# EAGLE design cypi (EAGLE 6.4)
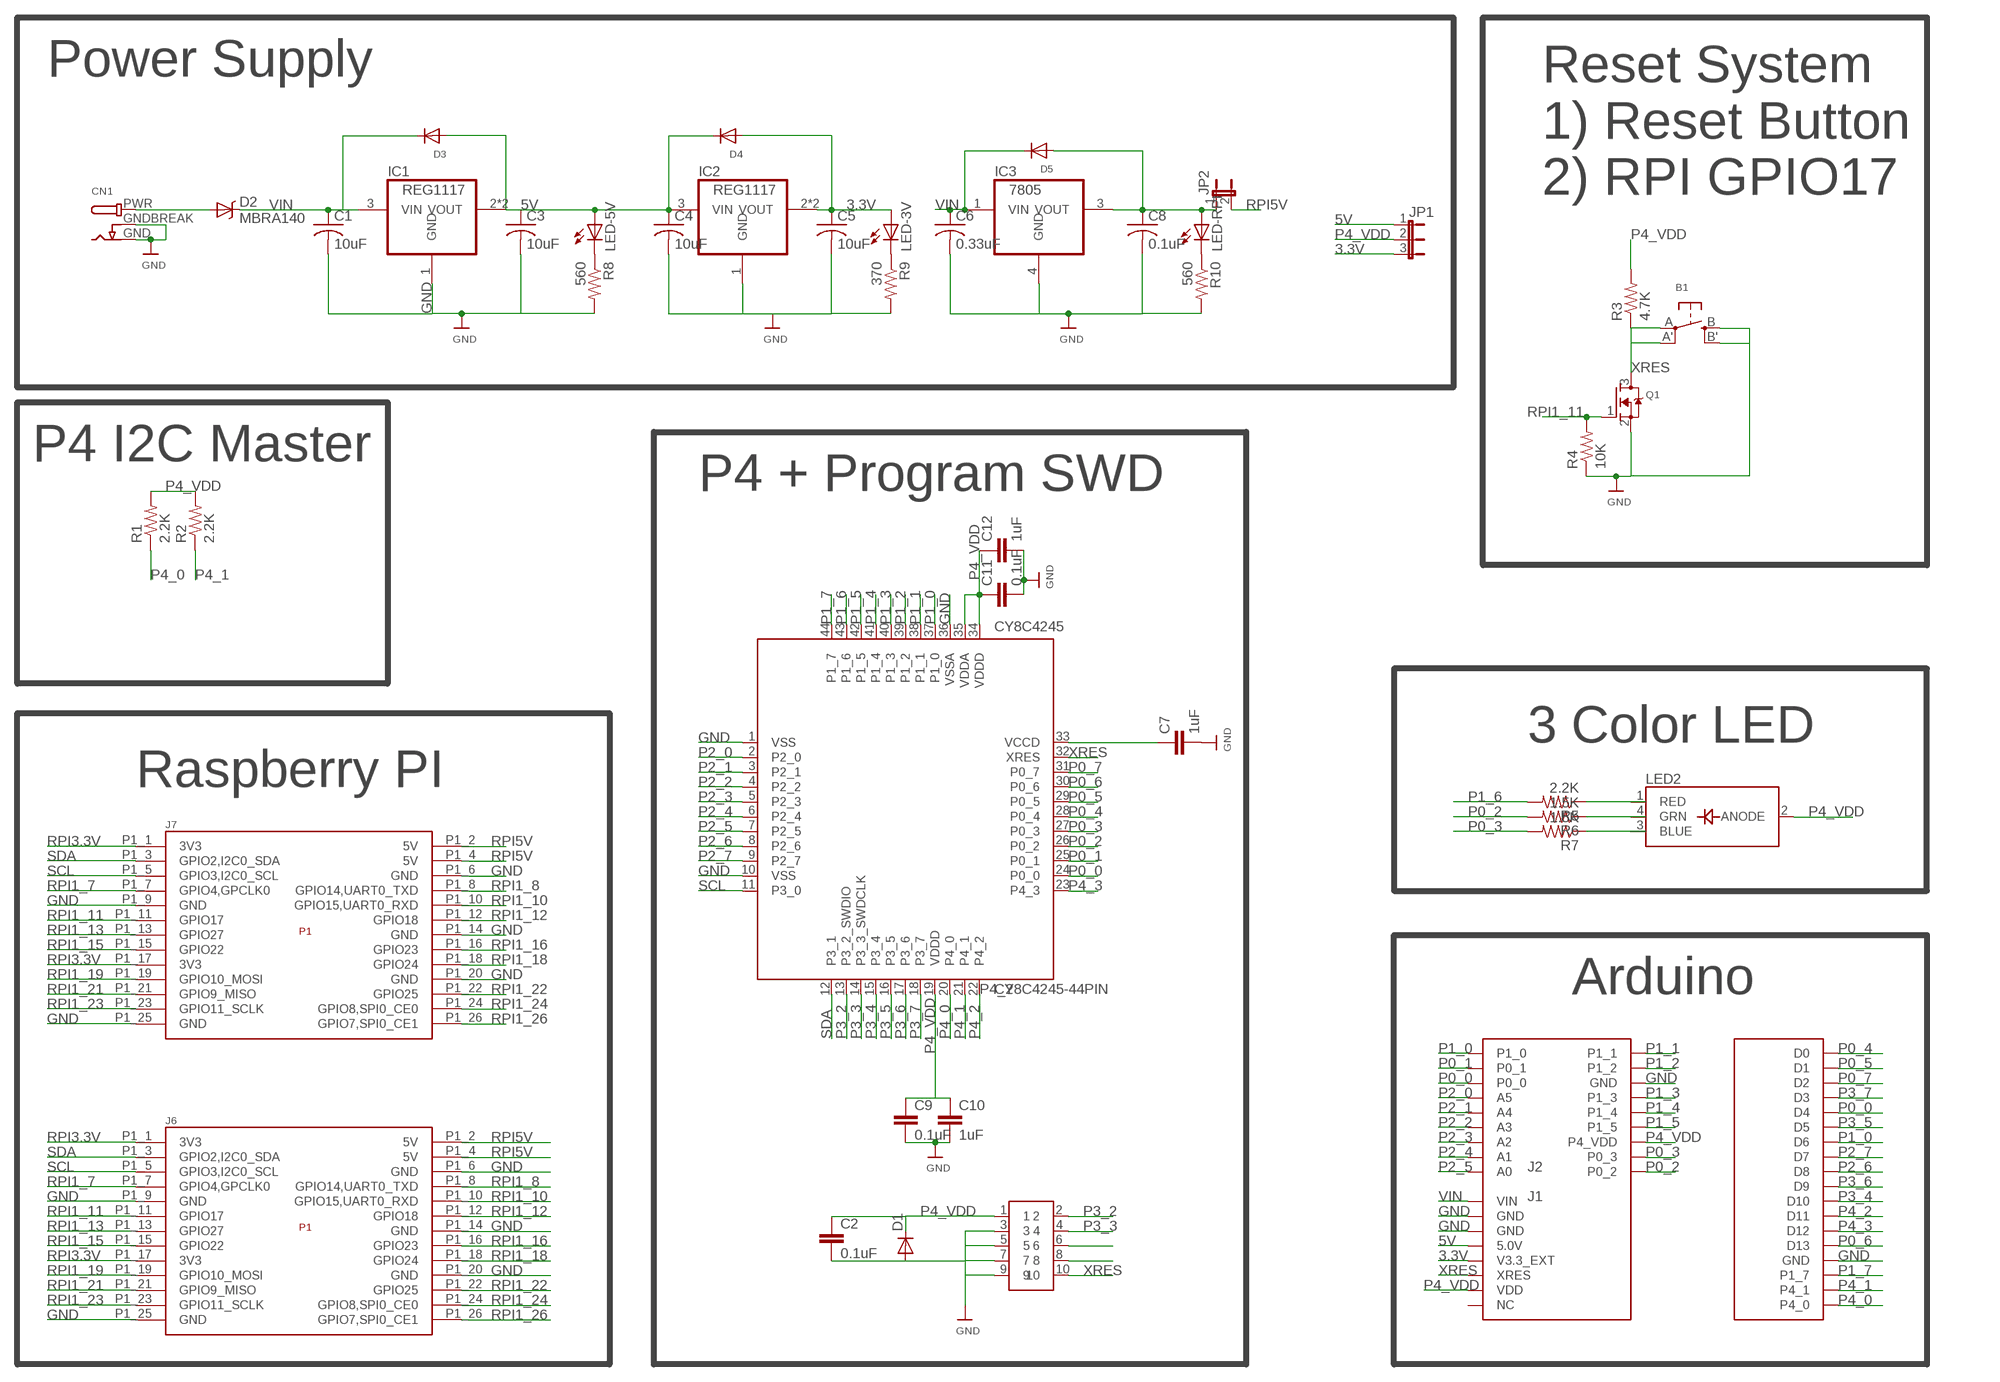
[diagram p0: schematic, sheet 1]

## Parts
B1  SWITCH_TACT_SMT  [EVQ-Q2]
C1  10uF  C-USC0805  [C0805]
C2  0.1uF  CAP1206  [1206]
C3  10uF  C-USC0805  [C0805]
C4  10uF  C-USC0805  [C0805]
C5  10uF  C-USC0805  [C0805]
C6  0.33uF  C-USC0805  [C0805]
C7  1uF  CAP1206  [1206]
C8  0.1uF  C-USC0805  [C0805]
C9  0.1uF  CAP1206  [1206]
C10  1uF  CAP1206  [1206]
C11  0.1uF  CAP1206  [1206]
C12  1uF  CAP1206  [1206]
CN1  DCBARRELPTH  [DCJACK_2MM_PTH]
CY8C4245  CY8C4245-44PIN  [TQFP-10X10-44]
D1  DIODEHV  [DIODE-HV]
D2  MBRA140  [SMA-DIODE]
D3  DIODESOD-123  [SOD-123]
D4  DIODESOD-123  [SOD-123]
D5  DIODESOD-123  [SOD-123]
IC1  REG1117  [SOT223]
IC2  REG1117  [SOT223]
IC3  7805  [DPAK]
J5  SAMTEC  [FTSH-105-01-XXX-DV-K]
J6  RASPBERRY-PI_REV2PINONLY  [RPI-PINS]
J7  RASPBERRY-PI_REV2  [RASPBERRY-PI_REV2]
JP1  JP2E  [JP2]
JP2  JUMPER-2PTH  [1X02]
LED2  LED_RGB_PLCC4  [RGBLED_PLCC4]
LED-3V  LEDCHIPLED_0805  [CHIPLED_0805]
LED-5V  LEDCHIPLED_0805  [CHIPLED_0805]
LED-RPI  LEDCHIPLED_0805  [CHIPLED_0805]
Q1  MOSFET-NREFLOW  [SOT23-R]
R1  2.2K  RESISTOR0805-RES  [0805]
R2  2.2K  RESISTOR0805-RES  [0805]
R3  4.7K  RESISTOR0805-RES  [0805]
R4  10K  RESISTOR0805-RES  [0805]
R5  2.2K  RESISTOR0805-RES  [0805]
R6  1.5K  RESISTOR0805-RES  [0805]
R7  1.5K  RESISTOR0805-RES  [0805]
R8  560  RESISTOR0805-RES  [0805]
R9  370  RESISTOR0805-RES  [0805]
R10  560  RESISTOR0805-RES  [0805]
U1  PIONEERNO_SILK  [PIONEER]

## Nets
3.3V [power]: C5.1 D4.A IC2.2(VOUT) IC2.4(VOUT) JP1.3 LED-3V.A U1.3.3V(V3.3_EXT)
5V [power]: C3.1 C4.1 D3.A D4.C IC1.2(VOUT) IC1.4(VOUT) IC2.3(VIN) JP1.1 LED-5V.A U1.5V(5.0V)
GND [power]: B1.B'(S1) B1.B(S) C1.2 C2.2 C3.2 C4.2 C5.2 C6.2 C7.2 C8.2 C9.2 C10.2 C11.2 C12.2 CN1.GND CN1.GNDBREAK CY8C4245.1(VSS) CY8C4245.10(VSS) CY8C4245.36(VSSA) D1.A IC1.1(GND) IC2.1(GND) IC3.4(GND) J5.3 J5.5 J5.7 J5.9 J6.P1_6(GND) J6.P1_9(GND) J6.P1_14(GND) J6.P1_20(GND) J6.P1_25(GND) J7.P1_6(GND) J7.P1_9(GND) J7.P1_14(GND) J7.P1_20(GND) J7.P1_25(GND) Q1.2(S) R4.1 R8.2 R9.2 R10.2 U1.GND@2(GND) U1.GND@3(GND) U1.GND@3R(GND) U1.GND@7(GND)
N$1: C7.1 CY8C4245.33(VCCD)
N$2 [power]: C8.1 D5.A IC3.3(VOUT) JP2.1 LED-RPI.A
N$3 [power]: CN1.PWR D2.A
N$4: J5.6
N$5: LED2.1(RED) R5.1
N$6: J5.8
N$7: LED2.4(GRN) R6.1
N$8: LED2.3(BLUE) R7.1
N$9: LED-5V.C R8.1
N$10: LED-3V.C R9.1
N$11: LED-RPI.C R10.1
P0_0: CY8C4245.24(P0_0) U1.D4 U1.P0_0
P0_1: CY8C4245.25(P0_1) U1.P0_1
P0_2: CY8C4245.26(P0_2) R6.2 U1.P0_2
P0_3: CY8C4245.27(P0_3) R7.2 U1.P0_3
P0_4: CY8C4245.28(P0_4) U1.D0
P0_5: CY8C4245.29(P0_5) U1.D1
P0_6: CY8C4245.30(P0_6) U1.D13
P0_7: CY8C4245.31(P0_7) U1.D2
P1_0: CY8C4245.37(P1_0) U1.D6 U1.P1_0
P1_1: CY8C4245.38(P1_1) U1.P1_1
P1_2: CY8C4245.39(P1_2) U1.P1_2
P1_3: CY8C4245.40(P1_3) U1.P1_3
P1_4: CY8C4245.41(P1_4) U1.P1_4
P1_5: CY8C4245.42(P1_5) U1.P1_5
P1_6: CY8C4245.43(P1_6) R5.2
P1_7: CY8C4245.44(P1_7) U1.AREF(P1_7)
P2_0: CY8C4245.2(P2_0) U1.A0(A5)
P2_1: CY8C4245.3(P2_1) U1.A1(A4)
P2_2: CY8C4245.4(P2_2) U1.A2(A3)
P2_3: CY8C4245.5(P2_3) U1.A3(A2)
P2_4: CY8C4245.6(P2_4) U1.A4(A1)
P2_5: CY8C4245.7(P2_5) U1.A5(A0)
P2_6: CY8C4245.8(P2_6) U1.D8
P2_7: CY8C4245.9(P2_7) U1.D7
P3_2: CY8C4245.13(P3_2_SWDIO) J5.2
P3_3: CY8C4245.14(P3_3_SWDCLK) J5.4
P3_4: CY8C4245.15(P3_4) U1.D10
P3_5: CY8C4245.16(P3_5) U1.D5
P3_6: CY8C4245.17(P3_6) U1.D9
P3_7: CY8C4245.18(P3_7) U1.D3
P4_0: CY8C4245.20(P4_0) R1.1 U1.SCL(P4_0)
P4_1: CY8C4245.21(P4_1) R2.1 U1.SDA(P4_1)
P4_2: CY8C4245.22(P4_2) U1.D11
P4_3: CY8C4245.23(P4_3) U1.D12
P4_VDD [power]: C2.1 C9.1 C10.1 C11.1 C12.1 CY8C4245.19(VDDD) CY8C4245.34(VDDD) CY8C4245.35(VDDA) D1.C J5.1 JP1.2 LED2.2(ANODE) R1.2 R2.2 R3.2 U1.P4_VDD U1.P4_VDD1(VDD)
RPI1_7: J6.P1_7(GPIO4,GPCLK0) J7.P1_7(GPIO4,GPCLK0)
RPI1_8: J6.P1_8(GPIO14,UART0_TXD) J7.P1_8(GPIO14,UART0_TXD)
RPI1_10: J6.P1_10(GPIO15,UART0_RXD) J7.P1_10(GPIO15,UART0_RXD)
RPI1_11: J6.P1_11(GPIO17) J7.P1_11(GPIO17) Q1.1(G) R4.2
RPI1_12: J6.P1_12(GPIO18) J7.P1_12(GPIO18)
RPI1_13: J6.P1_13(GPIO27) J7.P1_13(GPIO27)
RPI1_15: J6.P1_15(GPIO22) J7.P1_15(GPIO22)
RPI1_16: J6.P1_16(GPIO23) J7.P1_16(GPIO23)
RPI1_18: J6.P1_18(GPIO24) J7.P1_18(GPIO24)
RPI1_19: J6.P1_19(GPIO10_MOSI) J7.P1_19(GPIO10_MOSI)
RPI1_21: J6.P1_21(GPIO9_MISO) J7.P1_21(GPIO9_MISO)
RPI1_22: J6.P1_22(GPIO25) J7.P1_22(GPIO25)
RPI1_23: J6.P1_23(GPIO11_SCLK) J7.P1_23(GPIO11_SCLK)
RPI1_24: J6.P1_24(GPIO8,SPI0_CE0) J7.P1_24(GPIO8,SPI0_CE0)
RPI1_26: J6.P1_26(GPIO7,SPI0_CE1) J7.P1_26(GPIO7,SPI0_CE1)
RPI3.3V: J6.P1_1(3V3) J6.P1_17(3V3) J7.P1_1(3V3) J7.P1_17(3V3)
RPI5V [power]: J6.P1_2(5V) J6.P1_4(5V) J7.P1_2(5V) J7.P1_4(5V) JP2.2
SCL: CY8C4245.11(P3_0) J6.P1_5(GPIO3,I2C0_SCL) J7.P1_5(GPIO3,I2C0_SCL)
SDA: CY8C4245.12(P3_1) J6.P1_3(GPIO2,I2C0_SDA) J7.P1_3(GPIO2,I2C0_SDA)
VIN [power]: C1.1 C6.1 D2.C D3.C D5.C IC1.3(VIN) IC3.1(VIN) U1.VIN
XRES: B1.A'(P1) B1.A(P) CY8C4245.32(XRES) J5.10 Q1.3(D) R3.1 U1.XRES
Unconnected: U1.NC@8(NC)

## Notes on the sheet
- Power Supply
- Reset System
  1) Reset Button
  2) RPI GPIO17
- P4 I2C Master
- P4 + Program SWD
- 3 Color LED
- Raspberry PI
- Arduino
- J2
- J1

## Library data of the parts
B1 = microbuilder:SWITCH_TACT_SMT: SMT Tact Switches 6x6mm - Digikey: P12940SCT-ND KMR2 (4.6x2.8mm) - Digikey: 401-1426-1-ND EVQ-PQHB55 - Light Touch, 160GF (4.5x4.5mm) - Digikey: P8090SCT-ND
C1 C3-C6 C8 = adafruit:C-US: CAPACITOR, American symbol
C2 C7 C9-C12 = SparkFun-Passives:CAP: Capacitor Standard 0603 ceramic capacitor, and 0.1" leaded capacitor.
CN1 = microbuilder:DCBARREL: DC Barrel Jack DCJACK_1.3MM_PTH - Through Hole 1.3mm Jack (4UConnector: 05536) DCJACK_2MM_PTH - Through Hole 2.0/2.1 Jack (4UConnector: 05537) DCJACK_2MM_SMT - SMT 2.0/2.1mm Jack(4UConnector: 03267)
CY8C4245 = arh:CY8C4245-44PIN: Cypress PSoC4 8C4245
D1 = SparkFun-DiscreteSemi:DIODE: Diode
D2 = SparkFun-DiscreteSemi:MBRA140: 40V, 1A Schottky rectifier SMA/DO-214AC package DIO-08053; PROD_ID: DIO-08053
D3-D5 = adafruit:DIODE: Diode
IC1 IC2 = arh:REG1117: 800mA and 1A Low Dropout (LDO) Positive Regulator 1.8V, 2.5V, 2.85V, 3.3V, 5V, and Adj; MPN: REG1117; OC_FARNELL: 1097566; OC_NEWARK: 14P6981
IC3 = arh:7805
J5 = arh:SAMTEC
J6 J7 = arh:RASPBERRY-PI_REV2: Raspberry Pi Board <http://www.raspberrypi.org/> Jacques Lagnel V1.0 (beta) 2012 Mateusz Bawaj V1.1 (beta) 2012 Board dimension: Forum 3D model <http://www.raspberrypi.org/forum/general-discussion/mechanical-profile-3d-models?value=3d%20model&type=1&include=1&search=1&ret=all> The GPIO Connector (P1): http://elinux.org/RPi_Low-level_peripherals The GPIO Connector (P5): http://www.raspberrypi-spy.co.uk/2012/09/raspberry-pi-p5-header/
JP1 = jumper:JP2E: JUMPER
JP2 = SparkFun-Passives:JUMPER-2: Jumper Basic 0.1" spaced jumper. Use with breakaway headers.
LED2 = microbuilder:LED_RGB_PLCC4: RGB LED - PLCC4 Cree 20mA Common Anode Digikey: CLV1A-FKB-CJ1M1F1BB7R4S3CT-ND Red: 2.6V Vf, 550mcd Green: 3.2V Vf, 850mcd Blue: 3.2V Vf, 320mcd
LED-3V LED-5V LED-RPI = adafruit:LED: LED OSRAM: - CHIPLED LG R971, LG N971, LY N971, LG Q971, LY Q971, LO R971, LY R971 LH N974, LH R974 LS Q976, LO Q976, LY Q976 LO Q996 - Hyper CHIPLED LW Q18S LB Q993, LB Q99A, LB R99A - SideLED LS A670, LO A670, LY A670, LG A670, LP A670 LB A673, LV A673, LT A673, LW A673 LH A674 LY A675 LS A676, LA A676, LO A676, LY A676, LW A676 LS A679, LY A679, LG A679 - Hyper Micro SIDELED® LS Y876, LA Y876, LO Y876, LY Y876 LT Y87S - SmartLED LW L88C, LW L88S LB L89C, LB L89S, LG L890 LS L89K, LO L89K, LY L89K LS L896, LA L896, LO L896, LY L896 - TOPLED LS T670, LO T670, LY T670, LG T670, LP T670 LSG T670, LSP T670, LSY T670, LOP T670, LYG T670 LG T671, LOG T671, LSG T671 LB T673, LV T673, LT T673, LW T673 LH T674 LS T676, LA T676, LO T676, LY T676, LB T676, LH T676, LSB T676, LW T676 LB T67C, LV T67C, LT T67C, LS T67K, LO T67K, LY T67K, LW E67C LS E67B, LA E67B, LO E67B, LY E67B, LB E67C, LV E67C, LT E67C LW T67C LS T679, LY T679, LG T679 LS T770, LO T770, LY T770, LG T770, LP T770 LB T773, LV T773, LT T773, LW T773 LH T774 LS E675, LA E675, LY E675, LS T675 LS T776, LA T776, LO T776, LY T776, LB T776 LHGB T686 LT T68C, LB T68C - Hyper Mini TOPLED® LB M676 - Mini TOPLED Santana® LG M470 LS M47K, LO M47K, LY M47K Source: http://www.osram.convergy.de/
Q1 = microbuilder:MOSFET-N: N-Channel Mosfet LEGEND VDS: Voltage Drain-Source ID: Drain Current RDS(ON): Drain-Source On-State Resistance VGS(TH): Gate-Source Threshold Voltage CISS: Drain-Source Input Capacitance SOT-23 Name VDS ID RDS(ON) VGS(TH) CISS Order Number 2N7002E 60V 260mA 2.5 Ohm 2.5V @ 250uA 26.7pF @ 25V 2N7002ET1GOSTR-ND BSH103 30V 850mA 400 mOhm 400mV @ 1mA 83pF @ 24V BSH103,235-ND BSS138 60V 320mA 1.6 Ohm 1.5V @ 250uA 50pF @ 10V Mouser: 771-BSS138PW115 DMN2075U-7 20V 4.2A 38 mOhm 1V @ 250 uA 594.3pF @ 10V DMN2075U-7DICT-ND * BSS138 good choice for I2C level-shifting
R1-R10 = SparkFun-Passives:RESISTOR: Resistor Basic schematic elements and footprints for 0603, 1206, and PTH resistors.
U1 = arh:PIONEER: Arduino shield footprint

## Net classes
1 power: width 1.016 mm, clearance 0.254 mm

## Board
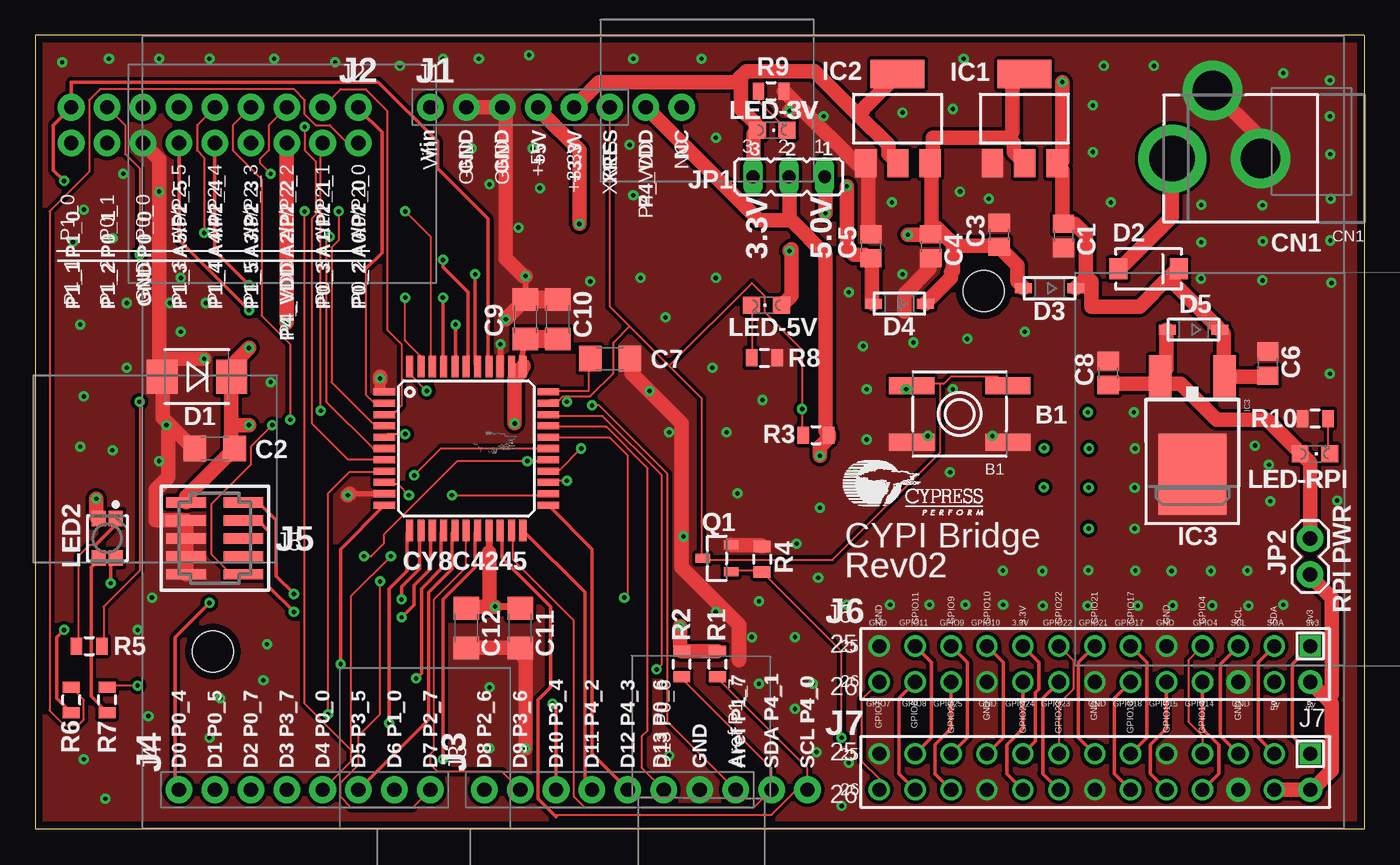
[diagram p1: board, top side]
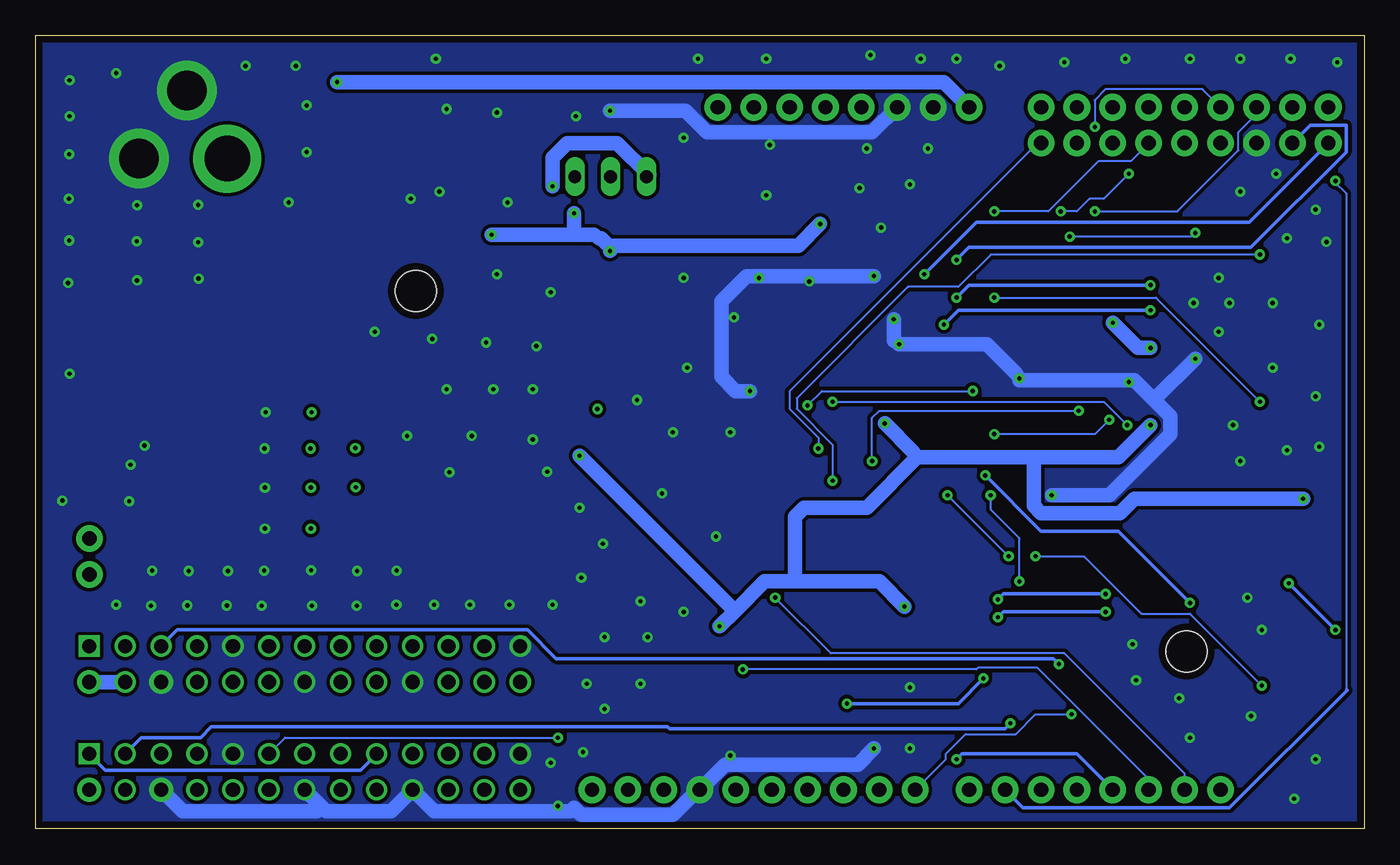
[diagram p2: board, bottom side, seen from below]

Size 93.99 x 56.08 mm. Coordinates in mm from the lower left corner, seen from the top.
Outline: 93.98,0 0,0 0,56.08 93.95,56.08
Outline: 93.98,0 93.98,0
Outline: 93.98,56.08 93.98,0
Copper layers (1*16): Top 0.0178mm / dielectric 59mil / Bottom 0.0178mm
Design rules "SSC-EAGLE-2Lyr_v1.0.0.3 *": minimum track width 6mil, minimum drill 14mil, track to track 6mil, track to pad 6mil, pad to pad 6mil, via to via 6mil, smd to smd 6mil, copper to edge 20mil, drill to drill 16mil, minimum pad ring 8mil, minimum via ring 8mil, stop-mask expansion 3mil, vias tented up to drill 14mil, thermal gap 10mil

### Footprints (pad centres in the part's own frame; a part is rotated, then mirrored left to right if it is on the bottom)
EVQ-Q2 = smd 3.2 x 1.2: A -3.4,-2; A' 3.4,-2; B -3.4,2; B' 3.4,2
C0805 = smd 1.3 x 1.5: 1 -0.85,0; 2 0.85,0
1206 = smd 1.6 x 1.8: 1 -1.4,0; 2 1.4,0
DCJACK_2MM_PTH = drill 2.8: GND 0,7.35; GNDBREAK 4.8,10.75 | drill 3.2: PWR 0,13.6
TQFP-10X10-44 = smd 1.5 x 0.5: 1 -5.8,4; 2 -5.8,3.2; 3 -5.8,2.4; 4 -5.8,1.6; 5 -5.8,0.8; 6 -5.8,0; 7 -5.8,-0.8; 8 -5.8,-1.6; 9 -5.8,-2.4; 10 -5.8,-3.2; 11 -5.8,-4; 23 5.8,-4; 24 5.8,-3.2; 25 5.8,-2.4; 26 5.8,-1.6; 27 5.8,-0.8; 28 5.8,0; 29 5.8,0.8; 30 5.8,1.6; 31 5.8,2.4; 32 5.8,3.2; 33 5.8,4 | smd 0.5 x 1.5: 12 -4,-5.8; 13 -3.2,-5.8; 14 -2.4,-5.8; 15 -1.6,-5.8; 16 -0.8,-5.8; 17 0,-5.8; 18 0.8,-5.8; 19 1.6,-5.8; 20 2.4,-5.8; 21 3.2,-5.8; 22 4,-5.8; 34 4,5.8; 35 3.2,5.8; 36 2.4,5.8; 37 1.6,5.8; 38 0.8,5.8; 39 0,5.8; 40 -0.8,5.8; 41 -1.6,5.8; 42 -2.4,5.8; 43 -3.2,5.8; 44 -4,5.8
DIODE-HV = smd 2.2 x 2.4: A 2.454,0; C -2.454,0
SMA-DIODE = smd 1.27 x 1.47: A -2.15,0; C 2.15,0
SOD-123 = smd 1.2 x 0.7: A 1.85,0; C -1.85,0
SOT223 = smd 1.499 x 2.007: 1 -2.261,-3.15; 2 0.025,-3.15; 3 2.311,-3.15 | smd 3.81 x 2.007: 4 0,3.15
DPAK = smd 1.6 x 3: 1 -2.28,-5.31; 3 2.28,-5.31 | smd 4.826 x 5.715: 4 0,1.588
FTSH-105-01-XXX-DV-K = smd 0.737 x 2.794: 1 -2.54,-2.032; 2 -2.54,2.032; 3 -1.27,-2.032; 4 -1.27,2.032; 5 0,-2.032; 6 0,2.032; 7 1.27,-2.032; 8 1.27,2.032; 9 2.54,-2.032; 10 2.54,2.032
RPI-PINS = drill 1 square: P1_1 0,-2.54 | drill 1 pad 1.676: P1_2 0,0; P1_6 5.08,0 | drill 1: P1_3 2.54,-2.54; P1_4 2.54,0; P1_5 5.08,-2.54; P1_7 7.62,-2.54; P1_8 7.62,0; P1_9 10.16,-2.54; P1_10 10.16,0; P1_11 12.7,-2.54; P1_12 12.7,0; P1_13 15.24,-2.54; P1_14 15.24,0; P1_15 17.78,-2.54; P1_16 17.78,0; P1_17 20.32,-2.54; P1_18 20.32,0; P1_19 22.86,-2.54; P1_20 22.86,0; P1_21 25.4,-2.54; P1_22 25.4,0; P1_23 27.94,-2.54; P1_24 27.94,0; P1_25 30.48,-2.54; P1_26 30.48,0
RASPBERRY-PI_REV2 = drill 1 square: P1_1 -41.91,21.59 | drill 1 pad 1.676: P1_2 -41.91,24.13; P1_6 -36.83,24.13 | drill 1: P1_3 -39.37,21.59; P1_4 -39.37,24.13; P1_5 -36.83,21.59; P1_7 -34.29,21.59; P1_8 -34.29,24.13; P1_9 -31.75,21.59; P1_10 -31.75,24.13; P1_11 -29.21,21.59; P1_12 -29.21,24.13; P1_13 -26.67,21.59; P1_14 -26.67,24.13; P1_15 -24.13,21.59; P1_16 -24.13,24.13; P1_17 -21.59,21.59; P1_18 -21.59,24.13; P1_19 -19.05,21.59; P1_20 -19.05,24.13; P1_21 -16.51,21.59; P1_22 -16.51,24.13; P1_23 -13.97,21.59; P1_24 -13.97,24.13; P1_25 -11.43,21.59; P1_26 -11.43,24.13 | hole 2.9: 35.69,14.365; -18.81,-11.135
JP2 = drill 0.914 long: 1 -2.54,0; 2 0,0; 3 2.54,0
1X02 = drill 1.016 pad 1.88: 1 0,0; 2 2.54,0
RGBLED_PLCC4 = smd 1.1 x 1: 1 -1.4,0.6; 2 -1.4,-0.6; 3 1.4,-0.6; 4 1.4,0.6
CHIPLED_0805 = smd 1.2 x 1.2: A 0,-1.05; C 0,1.05
SOT23-R = smd 0.635 x 1.016: 1 -0.95,-1; 2 0.95,-1; 3 0,1
0805 = smd 0.8 x 1.2: 1 -0.9,0; 2 0.9,0
PIONEER = drill 1.016 pad 1.88: 3.3V 50.8,13.97; 5V 50.8,16.51; A0 50.8,29.21; A1 50.8,31.75; A2 50.8,34.29; A3 50.8,36.83; A4 50.8,39.37; A5 50.8,41.91; AREF 2.54,2.54; D0 2.54,41.91; D1 2.54,39.37; D2 2.54,36.83; D3 2.54,34.29; D4 2.54,31.75; D5 2.54,29.21; D6 2.54,26.67; D7 2.54,24.13; D8 2.54,20.32; D9 2.54,17.78; D10 2.54,15.24; D11 2.54,12.7; D12 2.54,10.16; D13 2.54,7.62; GND@2 50.8,21.59; GND@3 50.8,19.05; GND@3R 48.26,44.45; GND@7 2.54,5.08; NC@8 50.8,6.35; P0_0 50.8,44.45; P0_1 50.8,46.99; P0_2 48.26,29.21; P0_3 48.26,31.75; P1_0 50.8,49.53; P1_1 48.26,49.53; P1_2 48.26,46.99; P1_3 48.26,41.91; P1_4 48.26,39.37; P1_5 48.26,36.83; P4_VDD 48.26,34.29; P4_VDD1 50.8,8.89; SCL 2.54,-2.54; SDA 2.54,0; VIN 50.8,24.13; XRES 50.8,11.43

### Placement (x,y rotation side)
B1  65.38,29.31 180 top
C1  72.72,41.91 270 top
C2  12.7,26.87 180 top
C3  68.17,41.99 90 top
C4  63.32,41.17 270 top
C5  59.11,41.17 90 top
C6  87.17,32.87 90 top
C7  40.64,33.22 0 top
C8  75.87,32.21 90 top
C9  34.67,36.02 90 top
C10  36.96,36.02 90 top
C11  34.29,14.17 270 top
C12  30.48,14.17 270 top
CN1  94.01,47.37 90 top
CY8C4245  30.48,26.87 0 top
D1  11.43,31.95 180 top
D2  78.74,39.57 0 top
D3  71.73,38.2 180 top
D4  61.11,37.11 180 top
D5  81.92,35.28 180 top
IC1  69.95,50.19 0 top
IC2  60.99,50.19 0 top
IC3  81.84,26.64 180 top
J5  12.7,20.52 270 top
J6  90.17,10.36 180 top
J7  48.26,26.87 180 top
JP1  53.29,46.1 180 top
JP2  90.17,20.5 270 top
LED2  5.08,20.52 270 top
LED-3V  52.12,49.38 270 top
LED-5V  51.71,37.01 90 top
LED-RPI  90.5,26.49 270 top
Q1  48.21,19.1 90 top
R1  48.26,11.63 90 top
R2  45.72,11.63 90 top
R3  55.22,27.81 0 top
R4  51.41,19.05 270 top
R5  3.81,12.9 0 top
R6  2.54,9.09 90 top
R7  5.08,9.09 90 top
R8  51.56,33.27 0 top
R9  52.04,52.15 0 top
R10  90.53,28.98 180 top
U1  52.07,0.2 90 top

### Tracks (layer width: path | path; a pad name or v marks a point on that pad's centre or on a via)
3.3V  (via drill 0.3)
  Top 1.016: D4.A 59.18,37.16 59.18,40.21 C5.1 58.67,40.59 57.91,40.59 57.4,41.1 v57.4,45.42 | JP1.3 50.8,46.18 50.8,49.1 51.05,49.35 LED-3V.A 50.93,49.86 49.91,50.88 49.91,52.78 49.78,52.78 | 58.23,50.43 55.12,53.54 50.29,53.54 49.78,53.04 49.78,52.78 | 58.23,50.43 60.33,48.34 60.33,47.7 60.96,47.07 IC2.2 | U1.3.3V 39.88,52.78 49.78,52.78 | IC2.4 60.96,53.29 58.55,50.88 58.55,50.75 58.23,50.43
  Bottom 1.016: v57.4,45.42 57.4,47.45 56.39,48.46 52.83,48.46 50.55,46.18 JP1.3
5V  (via drill 0.3)
  Top 1.016: 53.47,40.97 53.47,40.84 | 53.47,40.84 53.47,37.67 52.83,37.03 LED-5V.A | D3.A 69.85,38.3 69.47,38.68 69.47,39.83 68.2,41.1 C3.1 67.69,41.22 64.9,41.22 | C4.1 63.37,42.11 63.37,46.94 IC2.3 63.5,47.45 63.5,48.84 68.83,48.84 | 68.83,48.84 69.22,48.46 69.22,47.83 69.98,47.07 IC1.2 | 64.9,41.22 64.9,41.35 63.75,42.49 C4.1 | v61.72,41.99 62.87,41.99 C4.1 | v38.48,42.75 38.48,47.96 35.81,50.62 U1.5V | 64.9,41.22 64.9,39.45 64.77,39.32 64.77,38.94 62.99,37.16 D4.C | v53.34,40.84 53.47,40.84 | v55.88,43.51 55.88,46.05 JP1.1 | IC1.4 69.85,53.29 69.09,52.53 69.09,49.23 68.83,48.84
  Bottom 1.016: v61.72,41.99 55.88,41.99 | 55.88,41.99 54.48,41.99 54.1,41.73 53.98,41.73 53.59,41.35 53.18,41.08 | v38.48,42.75 40.01,41.22 53.09,41.22 53.18,41.08 | v53.34,40.84 53.18,41.08 | v55.88,43.51 55.88,41.99
GND  (via drill 0.3)
  Top 0.406: C9.2 v34.67,39.07 | CY8C4245.10 22.23,23.67 22.23,23.7 | CY8C4245.1 24.38,31 | CY8C4245.36 32.89,32.67 v32.89,34.24
  Top 0.762: 24.38,31 24.38,31.7
  Top 1.016: J5.9 J5.7 J5.5 J5.3 8.51,21.79 8.51,23.95 9.4,24.84 9.4,28.02 9.72,28.33 | 9.72,28.33 9.02,29.03 9.02,31.95 D1.A 8.76,32.33 8.76,33.22 | 9.72,28.33 11.18,26.87 C2.2 | U1.GND@3R 8.76,47.32 8.76,33.22 | U1.GND@2 U1.GND@3 33.27,50.75 33.27,40.34 34.54,39.07 v34.67,39.07 | 34.42,12.27 34.67,12.01 v34.67,5.66 | Q1.2 49.28,20.02 51.31,20.02 R4.1 | 58.29,46.81 53.85,51.26 | 53.85,51.26 52.96,52.15 R9.2 | 42.16,33.22 42.16,32.21 v43.43,30.94 45.72,28.65 45.72,18.49 49.78,14.43 49.78,11.89 | v22.1,23.57 22.23,23.67 | 24.38,31.95 v24.38,31.83 24.38,31.7 | v33.27,36.02 34.29,37.03 C9.2 | v11.94,33.22 8.76,33.22 | 58.93,46.69 58.93,42.11 C5.2 | 63.25,40.08 63.25,39.57 61.47,37.8 61.47,36.53 | v53.34,50.75 53.85,51.26 | C12.2 C11.2 | 86.61,47.32 CN1.GND 86.49,47.83 86.49,48.97 83.31,52.15 CN1.GNDBREAK
  Top 1.27: C9.2 C10.2
  Bottom 0.406: v34.67,39.07 34.67,39.19
  Bottom 1.016: v34.67,5.66 35.81,4.52 45.21,4.52 U1.GND@7 47.37,2.49 48.9,0.97 55.37,0.97 55.88,1.47 56.13,1.22 65.79,1.22 J7.P1_20 68.83,1.22 73.41,1.22 73.72,1.54 | J7.P1_14 73.72,1.54 | J7.P1_6 83.57,1.22 74.04,1.22 73.72,1.54 | v43.43,30.94 44.45,30.94 45.47,31.95 45.47,37.29 43.69,39.07 v34.67,39.07 | 30.73,51 U1.GND@2 | v22.1,23.57 18.03,23.57 13.72,27.89 13.72,29.16 14.86,30.3 | 14.86,30.3 16.26,31.7 24.38,31.7 v24.38,31.83 24.64,32.21 26.67,34.24 v32.89,34.24 33.27,34.49 v33.27,36.02 | 14.86,30.3 v11.94,33.22 | v53.34,50.75 48.01,50.75 46.48,49.23 34.8,49.23 U1.GND@3
  other vias: 53.85,20.14 55.37,17.73 57.4,15.82 60.45,15.82 63.25,15.82 65.79,15.82 68.45,15.82 71.25,15.75 74.42,15.75 77.98,15.75 80.44,15.77 83.24,15.77 85.8,15.75 88.27,15.82 91.57,32.16 91.67,38.58 91.59,41.58 91.62,44.53 91.59,47.68 91.57,50.37 91.57,52.91 88.27,53.42 79.12,53.92 75.56,53.92 74.8,51.13 74.8,47.83 86.82,41.53 82.47,41.45 55.5,22.68 57.78,25.22 58.8,27.51 58.8,31.06 58.55,34.11 62.1,34.37 65.91,34.62 69.98,35.13 49.66,23.7 30.86,48.08 32.13,45.54 34.16,42.49 39.24,38.68 44.58,36.14 47.88,32.59 48.13,38.94 48.13,48.84 76.07,44.27 82.47,44.09 35.18,48.08 35.69,45.29 42.8,38.94 53.72,13.54 51.18,16.08 48.13,15.32 50.67,13.54 54.99,10.24 71.22,18.21 74.47,18.26 85.72,18.24 87.25,25.73 51.44,30.3 67.69,27.76 63.12,27.76 82.45,38.89 86.79,38.76 44.83,28.02 3.43,30.56 2.67,41.48 3.17,35.64 6.48,37.16 9.53,37.16 3.17,27 3.43,4.9 4.95,2.11 16.38,13.03 12.32,6.43 13.08,9.22 16.13,10.49 31.37,54.43 34.92,54.69 42.29,54.43 47.12,54.43 25.78,53.92 5.21,54.43 1.91,54.18 8.76,54.43 12.32,54.43 16.89,54.43 21.21,54.18 5.46,26.75 9.27,28.52 8.26,16.33 7.24,14.05 8,7.95 6.48,32.59 8.76,45.03 48.9,28.02 51.18,10.24 55.24,5.41 65.66,54.43 65.41,45.03 61.34,50.62 64.9,50.88 42.29,44.78 42.04,48.34 10.29,38.94 12.06,37.16 10.29,35.13 8.76,25.98 16.64,31.57 6.22,46.3 3.43,43.76 5.46,41.73 28.83,54.43 45.85,20.65 53.72,8.46 57.53,4.65 57.02,1.6 92.08,23.19 57.53,37.92 67.44,44.53 61.59,31.06 64.9,31.06 60.58,44.27 55.75,50.37 61.34,39.19 44.83,5.16 32.13,9.98 32.13,5.66 68.43,18.24 77.8,18.24 80.37,18.21 83.13,18.21 64.69,25.2 77.7,29.44 77.77,26.87 77.75,24.1 77.75,21.21 86.79,44.07 86.26,27.08 87.35,23.14
  pour Bottom (no thermals): -1.04,56.87 94.74,56.87 94.74,-1.98 -1.22,-1.98 -1.22,56.77
  pour Top (no thermals): -1.04,56.87 94.74,56.87 94.74,-1.98 -1.22,-1.98 -1.22,56.77
GND1  (via drill 0.3)
  other vias: 74.45,29.44 74.52,26.87 74.5,24.1 74.5,21.21
GND2  (via drill 0.3)
  other vias: 71.35,26.9 71.32,24.13
N$1
  Top 0.152: CY8C4245.33 36.32,30.94 39.12,30.94 39.12,33.22 C7.1
N$2
  Top 1.016: JP2.1 90.17,25.86 89.53,26.49 LED-RPI.A 89.15,26.87 87.12,28.91 83.57,28.91 81.03,31.45 80.01,31.45 IC3.3 | D5.A 80.01,35.26 80.01,32.46 79.76,32.21 IC3.3 | C8.1 75.95,31.45 79.5,31.45 IC3.3
N$3
  Top 1.016: D2.A 76.71,39.57 80.39,43.26 80.39,47.32 CN1.PWR
N$5
  Top 0.152: R5.1 3.05,12.9 3.05,19.25 3.81,20.02 4.32,20.02 4.25,20.08
  Top 0.254: 4.19,20.02 4.25,20.08 5.46,21.29 5.46,21.79 5.59,21.92 LED2.1 | 2.92,12.9 R5.1
N$7  (via drill 0.3)
  Top 0.254: v5.33,17.35 5.33,18.75 5.59,19 LED2.4 | v2.03,14.05 1.52,13.54 1.52,9.22 2.54,8.2 R6.1
  Bottom 0.254: v2.03,14.05 v5.33,17.35
N$8
  Top 0.254: LED2.3 4.45,19 3.94,18.49 3.94,9.35 5.08,8.2 R7.1
N$9
  Top 0.152: R8.1 50.67,33.35 50.67,36.91 LED-5V.C
N$10
  Top 0.152: LED-3V.C 53.09,49.48 51.18,51.38 51.18,52.15 R9.1
N$11
  Top 0.152: R10.1 91.44,28.91 91.44,26.49 LED-RPI.C
N$15
  Top 0.508: 33.81,16.1 33.81,16.13
P0_0  (via drill 0.3)
  Top 0.152: v29.46,23.57 36.07,23.57 CY8C4245.24 | v25.15,19.25 22.35,16.46 22.35,5.54 | 22.35,5.54 22.35,4.78 U1.D4 | v19.05,43.64 19.05,8.84 22.35,5.54
  Bottom 0.152: v25.15,19.25 v29.46,23.57 | U1.P0_0 7.62,50.5 8.89,49.23 8.89,47.96 13.21,43.64 v19.05,43.64
P0_1  (via drill 0.3)
  Top 0.152: v37.59,24.59 36.32,24.59 CY8C4245.25 | v7.37,40.59 7.37,46.69 6.35,47.7 6.35,49.73 U1.P0_1
  Bottom 0.152: v37.59,24.59 37.59,27.13 40.13,29.67 40.13,30.43 32.26,38.3 28.7,38.3 26.42,40.59 v7.37,40.59
P0_2  (via drill 0.3)
  Top 0.152: R6.2 3.43,9.09 3.43,7.7 3.05,7.32 2.03,7.32 1.02,8.33 1.02,43.64 3.81,46.43 3.81,51.51 4.57,52.27 18.29,52.27 19.05,51.51 19.05,50.5 19.81,49.73 20.83,49.73 22.1,48.46 U1.P0_2 | v38.61,26.87 37.08,25.35 36.32,25.35 CY8C4245.26
  Bottom 0.152: v38.61,26.87 38.61,27.64 40.64,29.67 40.64,30.94 23.11,48.46 U1.P0_2
P0_3  (via drill 0.3)
  Top 0.152: v7.24,10.11 5.08,10.11 R7.2 | v23.24,19.25 23.75,19.25 24.64,20.14 24.64,20.78 29.84,25.98 v34.8,25.98 36.2,25.98 CY8C4245.27 | U1.P0_3 20.19,48.34 v20.19,29.54
  Top 0.254: 36.32,25.98 CY8C4245.27
  Bottom 0.152: v7.24,10.11 12.32,15.19 15.75,15.19 19.81,19.25 v23.24,19.25 | v20.19,29.54 34.29,29.54 34.8,29.03 v34.8,25.98
P0_4  (via drill 0.3)
  Top 0.152: CY8C4245.28 28.7,26.87 v26.8,24.97
  Top 0.254: v12.32,15.95 9.91,13.54 9.91,3 U1.D0
  Bottom 0.254: v26.8,24.97 22.86,21.03 17.4,21.03 v12.32,15.95
P0_5  (via drill 0.3)
  Top 0.152: v41.66,16.33 41.91,16.33 41.91,26.37 40.64,27.64 36.32,27.64 CY8C4245.29
  Bottom 0.152: v41.66,16.33 37.72,12.4 21.21,12.4 12.7,3.89 U1.D1
P0_6
  Top 0.152: U1.D13 42.93,4.27 42.93,6.55 43.31,6.93 43.31,25.48 40.39,28.4 36.32,28.4 CY8C4245.30
P0_7  (via drill 0.3)
  Top 0.152: v43.94,11.25 44.32,11.63 44.32,24.97 40.13,29.16 36.32,29.16 CY8C4245.31
  Bottom 0.152: v43.94,11.25 27.43,11.25 27.3,11.38 23.11,11.38 14.86,3.12 U1.D2
P1_0  (via drill 0.3)
  Top 0.254: CY8C4245.37 32,32.72 32,43.13 28.45,46.69 28.45,48.59 24.26,52.78 2.54,52.78 U1.P1_0 1.27,49.73 1.27,46.56 v2.03,45.8
  Bottom 0.152: 1.21,9.79 1.27,9.86 1.27,44.91 2.03,45.67 v2.03,45.8
  Bottom 0.254: U1.D6 24.13,1.47 9.53,1.47 1.21,9.79
P1_1  (via drill 0.3)
  Top 0.254: v31.11,39.19 31.11,32.84 31.24,32.72 CY8C4245.38
  Bottom 0.254: v31.11,39.19 27.43,42.88 8.13,42.88 U1.P1_1
P1_2  (via drill 0.3)
  Top 0.254: v28.83,40.21 28.83,39.7 30.61,37.92 30.61,32.84 30.48,32.72 CY8C4245.39
  Bottom 0.254: v28.83,40.21 27.94,41.1 8,41.1 1.27,47.83 1.27,49.73 3.81,49.73 U1.P1_2
P1_3  (via drill 0.3)
  Top 0.254: v29.72,35.64 29.72,32.72 CY8C4245.40 | v15.11,36.65 10.16,41.61 U1.P1_3
  Bottom 0.254: v29.72,35.64 28.7,36.65 v15.11,36.65
P1_4  (via drill 0.3)
  Top 0.254: v28.83,37.54 28.83,32.72 CY8C4245.41 | v15.11,38.43 12.7,40.84 U1.P1_4
  Bottom 0.254: v28.83,37.54 27.94,38.43 v15.11,38.43
P1_5  (via drill 0.3)
  Top 0.152: v26.16,43.64 27.94,41.86 27.94,32.72 CY8C4245.42
  Bottom 0.152: v26.16,43.64 22.35,43.64 18.8,47.19 16.51,47.19 U1.P1_5
P1_6  (via drill 0.3)
  Top 0.152: v7.37,30.18 7.37,18.24 4.83,15.7 4.83,12.9 R5.2 | v26.16,37.54 26.16,34.49 27.18,33.48 27.18,32.72 CY8C4245.43
  Bottom 0.152: v7.37,30.18 14.73,37.54 v26.16,37.54
P1_7  (via drill 0.3)
  Top 0.152: v27.69,30.94 26.67,31.95 26.67,32.46 CY8C4245.44 | v39.37,29.92 39.88,29.92 44.7,25.1 44.7,7.57 U1.AREF
  Bottom 0.152: v27.69,30.94 38.35,30.94 v39.37,29.92
P2_0
  Top 0.152: 24.64,30.18 23.88,30.18 23.37,30.68 23.37,39.57
  Top 0.254: 23.37,39.57 24.51,40.72 24.51,49.23 22.86,50.88 U1.A0 | 24.64,30.18 CY8C4245.2
P2_1
  Top 0.152: U1.A1 21.59,52.27 23.37,52.27 24.89,50.75 24.89,35.26 25.91,34.24 25.91,29.92 25.4,29.41 24.89,29.41 CY8C4245.3
P2_2  (via drill 0.3)
  Top 0.152: v21.46,43.64 21.46,41.61 20.95,41.1 20.95,31.57 24,28.52 24.64,28.52 CY8C4245.4 | v16.64,46.3 15.88,47.07 15.88,47.32 16.51,47.96 16.51,49.73 U1.A2
  Bottom 0.152: v21.46,43.64 20.32,43.64 19.43,44.53 18.41,44.53 v16.64,46.3
P2_3  (via drill 0.3)
  Top 0.152: v26.16,27.89 24.89,27.89 CY8C4245.5 | v18.03,28.91 18.03,34.24 16,36.27 16,45.92 13.97,47.96 13.97,49.73 U1.A3
  Bottom 0.152: v26.16,27.89 19.05,27.89 v18.03,28.91
P2_4  (via drill 0.3)
  Top 0.152: CY8C4245.6 23.88,26.87 20.57,30.18 20.57,41.61 v20.83,41.86 | v11.94,42.11 11.94,47.45 11.43,47.96 11.43,49.73 U1.A4
  Bottom 0.152: v20.83,41.86 12.19,41.86 v11.94,42.11
P2_5  (via drill 0.3)
  Top 0.152: v19.05,49.61 19.05,47.96 19.81,47.19 19.81,43.38 19.56,43.13 19.56,28.65 22.1,26.11 24.64,26.11 CY8C4245.7
  Bottom 0.152: v19.05,49.61 19.05,51.51 18.29,52.27 11.43,52.27 U1.A5
P2_6  (via drill 0.3)
  Top 0.152: v20.7,8.08 20.7,23.7 22.23,25.22 24.64,25.22 CY8C4245.8
  Bottom 0.152: v20.7,8.08 23.24,8.08 24.64,6.68 28.19,6.68 29.59,5.28 29.59,4.9 U1.D8
P2_7  (via drill 0.3)
  Top 0.152: v26.42,23.57 25.65,24.33 24.89,24.33 CY8C4245.9 | v24.38,17.48 24.38,8.08 22.86,6.55 22.86,4.52 21.59,3.25 21.59,2.24 22.35,1.47 26.67,1.47 U1.D7
  Bottom 0.152: v26.42,23.57 26.42,22.56 24.38,20.52 v24.38,17.48
P3_2  (via drill 0.3)
  Top 0.254: v25.91,16.21 25.91,17.09 27.18,18.36 27.18,21.03 CY8C4245.13 | v18.29,16.59 17.02,17.86 17.02,21.79 15.75,23.06 J5.2
  Bottom 0.254: v25.91,16.21 25.53,16.59 v18.29,16.59
P3_3  (via drill 0.3)
  Top 0.254: v25.91,14.94 26.8,15.82 26.8,17.22 27.94,18.36 27.94,20.9 28.07,21.03 CY8C4245.14 | v18.29,15.32 16.51,17.09 16.51,21.03 15.75,21.79 J5.4
  Bottom 0.254: v25.91,14.94 25.53,15.32 v18.29,15.32
P3_4  (via drill 0.3)
  Top 0.254: v26.92,10.62 27.3,11 27.3,16.97 28.7,18.36 28.7,20.9 28.83,21.03 CY8C4245.15 | v36.58,8.84 36.83,8.59 U1.D10
  Bottom 0.254: v26.92,10.62 28.7,8.84 v36.58,8.84
P3_5
  Top 0.254: U1.D5 27.81,7.7 27.81,16.71 29.46,18.36 29.46,20.9 29.59,21.03 CY8C4245.16
P3_6
  Top 0.152: CY8C4245.17 30.48,18.49 28.19,16.21 28.19,5.54 27.94,5.28 27.94,4.52 28.45,4.01 33.02,4.01 U1.D9
P3_7  (via drill 0.3)
  Top 0.254: v28.83,4.9 28.83,16.21 31.11,18.49 31.11,20.9 31.24,21.03 CY8C4245.18
  Bottom 0.254: v28.83,4.9 28.45,5.28 20.32,5.28 U1.D3
P4_0
  Top 0.152: R1.1 48.26,10.62 54.61,4.27 U1.SCL 53.85,2.74 52.07,0.97 36.83,0.97 36.77,0.9
  Top 0.254: 36.83,0.84 36.77,0.9 35.56,2.11 35.56,9.09 36.45,9.98 36.45,15.7 33.02,19.13 33.02,20.9 32.89,21.03 CY8C4245.20
P4_1
  Top 0.152: R2.1 45.72,10.62 52.07,4.27 U1.SDA 50.8,1.47 38.86,1.47 38.1,2.24 38.1,14.68 33.78,19 33.78,21.03 CY8C4245.21
P4_2
  Top 0.254: U1.D11 38.86,3.25 38.86,16.71 34.54,21.03 CY8C4245.22
P4_3
  Top 0.254: U1.D12 39.37,5.28 39.37,19.76 36.32,22.81 CY8C4245.23
P4_VDD  (via drill 0.3)
  Top 0.406: 34.54,32.72 34.29,32.72 C9.1
  Top 0.508: CY8C4245.35 CY8C4245.34 34.54,32.67 | CY8C4245.19 | CY8C4245.19 32.08,19.53 | C11.1 34.29,15.6 34.19,15.7 v32.51,15.7
  Top 1.016: J5.1 10.67,23.44 C2.1 13.84,27.25 13.84,28.52 | v17.78,35.76 U1.P4_VDD | v15.11,33.99 14.22,33.1 14.22,32.33 D1.C 13.84,31.45 13.84,28.52 | R1.2 R2.2 45.59,13.03 v45.59,14.3 | v32.51,15.7 32.13,15.7 | 32.13,15.7 30.48,15.7 C12.1 | v15.11,28.52 13.84,28.52 | v55.5,26.37 55.5,27 56.13,27.64 R3.2 56.13,27.89 55.88,28.14 55.88,40.59 53.47,43 | 34.54,32.67 34.54,32.72 CY8C4245.34 34.29,32.21 33.91,31.83 v33.91,28.65 | 32.13,15.7 32.13,19.38 32.08,19.53 | 53.47,43 53.34,43.13 53.34,45.92 JP1.2 | v4.32,23.32 4.32,22.05 LED2.2 | U1.P4_VDD1 51.18,43 53.47,43
  Top 1.27: C9.1 C10.1
  Bottom 1.016: v17.78,35.76 16,33.99 v15.11,33.99 | v32.51,15.7 34.29,17.48 40.26,17.48 | 40.26,17.48 42.42,17.48 44.51,15.38 | v45.59,14.3 44.51,15.38 | v15.11,28.52 17.4,26.24 23.37,26.24 | 31.62,26.24 23.37,26.24 | 31.62,26.24 35.18,22.68 39.62,22.68 40.26,22.05 40.26,17.48 | 44.51,15.38 v55.5,26.37 | v33.91,28.65 31.88,26.62 31.62,26.24 | v4.32,23.32 16.26,23.32 17.27,22.3 22.86,22.3 23.37,22.81 23.37,26.24
RPI1_7
  Top 0.152: J7.P1_7 82.55,6.55 81.53,7.57 81.53,11.89 J6.P1_7
RPI1_8
  Top 0.254: J7.P1_8 83.69,3.89 83.69,5.92 82.55,7.06 J6.P1_8
RPI1_10
  Top 0.254: J7.P1_10 78.87,3.89 78.87,5.92 80.01,7.06 J6.P1_10
RPI1_11  (via drill 0.3)
  Top 0.152: Q1.1 49.28,18.24 51.31,18.24 R4.2 51.44,18.11 57.02,12.52 v57.02,6.43
  Top 0.254: J7.P1_11 78.61,6.43 78.61,11.76 J6.P1_11 77.6,12.9
  Bottom 0.152: v57.02,6.43 76.33,6.43 J7.P1_11
RPI1_12
  Top 0.254: J7.P1_12 76.33,3.89 76.33,9.22 J6.P1_12
RPI1_13
  Top 0.254: J7.P1_13 73.79,6.43 73.79,11.76 J6.P1_13
RPI1_15
  Top 0.152: J7.P1_15 72.39,8.84 73.41,9.86 73.41,11.89 J6.P1_15
RPI1_16
  Top 0.254: J7.P1_16 71.25,3.89 71.25,9.22 J6.P1_16
RPI1_18
  Top 0.254: J7.P1_18 68.71,3.89 68.71,5.92 69.85,7.06 J6.P1_18
RPI1_19
  Top 0.254: J7.P1_19 68.45,6.43 68.45,11.76 J6.P1_19
RPI1_21
  Top 0.254: J7.P1_21 65.91,6.43 65.91,11.76 J6.P1_21
RPI1_22
  Top 0.254: J7.P1_22 63.63,3.89 63.63,5.92 64.77,7.06 J6.P1_22
RPI1_23
  Top 0.254: J7.P1_23 63.37,6.43 63.37,11.76 J6.P1_23
RPI1_24
  Top 0.254: J7.P1_24 61.09,3.89 61.09,9.22 J6.P1_24
RPI1_26
  Top 0.152: J7.P1_26 59.69,3.51 58.42,4.78 58.42,9.09 J6.P1_26
RPI3.3V
  Top 0.254: J7.P1_17 70.74,6.17 70.74,9.6 70.99,9.86 70.99,11.76 J6.P1_17 | J7.P1_1 88.9,6.55 88.9,11.63 J6.P1_1
  Bottom 0.254: J7.P1_17 70.99,4.14 89.03,4.14 J7.P1_1
RPI5V
  Top 1.016: J7.P1_4 J7.P1_2 90.55,3 91.69,4.14 91.69,8.84 91.38,9.16 | J6.P1_2 91.38,9.16 | JP2.2 90.17,17.86 91.69,16.33 91.69,9.47 91.38,9.16
  Bottom 1.016: J6.P1_2 J6.P1_4
SCL  (via drill 0.3)
  Top 0.254: v21.59,11.63 21.59,19.76 24.64,22.81 CY8C4245.11 | J7.P1_5 83.82,6.55 83.82,11.63 J6.P1_5
  Bottom 0.254: v21.59,11.63 21.97,12.01 57.15,12.01 59.18,14.05 83.95,14.05 J6.P1_5
SDA  (via drill 0.3)
  Top 0.254: v25.02,7.44 25.02,16.97 26.29,18.24 26.29,20.9 26.42,21.03 CY8C4245.12 | J6.P1_3 86.49,11.76 86.49,6.43 J7.P1_3
  Bottom 0.254: v25.02,7.44 25.4,7.06 49.15,7.06 49.28,7.19 81.53,7.19 82.3,6.43 86.49,6.43 J7.P1_3
VIN  (via drill 0.3)
  Top 1.016: 74.3,38.94 73.66,38.3 D3.C | 74.3,38.94 74.3,41.99 73.53,42.75 72.77,42.75 C1.1 72.64,43.26 72.64,46.56 72.26,46.94 IC1.3 72.64,47.19 v72.64,52.78 | 80.14,38.94 78.11,36.91 74.68,36.91 74.68,38.68 74.3,38.94 | 80.14,38.94 80.77,39.57 D2.C | 80.14,38.94 83.57,35.51 D5.C 84.07,35 84.07,32.46 IC3.1 84.33,31.95 87.12,31.95 C6.1
  Bottom 1.016: U1.VIN 29.72,52.78 v72.64,52.78
XRES  (via drill 0.3)
  Top 0.152: 42.04,35.51 44.83,32.72 | 44.83,32.72 47.12,30.43 47.12,19.13 Q1.3 47.24,19 56.39,19 64.01,26.62 64.01,31.45 | 42.04,35.51 40.89,34.37 40.89,32.21 39.24,30.56 37.59,30.56 | 37.59,30.56 37.34,30.56 37.08,30.3 36.45,30.3 36.32,30.18 CY8C4245.32 | 44.83,32.72 50.67,38.56 51.56,37.67 51.56,36.53 54.23,33.86 v54.23,29.67 54.23,27.89 R3.1 | J5.10 13.84,17.98 12.45,19.38 12.45,22.94 15.24,25.73 15.24,27 v16.76,28.52 | 37.59,30.56 v37.59,30.18 | U1.XRES 40.64,36.91 42.04,35.51 | 64.01,31.45 64.26,31.45 64.77,31.95 68.07,31.95 68.58,31.45 B1.A | 64.01,31.45 62.23,31.45 B1.A'
  Bottom 0.152: v16.76,28.52 18.41,30.18 v37.59,30.18

### Text on the board
tNames: J2 | J1 | 3.3V | 5.0V | LED2 | J4 | J3
_tsilk: J2 | J1 | R9 | IC2 | IC1 | LED-3V | Vin | GND | GND | +5V | +3.3V | XRES | P4_VDD | NC | 3 | 2 | 1 | JP1 | 3.3V | 5.0V | C1 | C4 | D2 | CN1 | C3 | P1_1 | P1_0 | P1_2 | P0_1 | GND | P0_0 | P1_3 | A5/P2_5 | P1_4 | A4/P2_4 | P1_5 | A3/P2_3 | P4_VDD | A2/P2_2 | P0_3 | A1/P2_1 | P0_2 | A0/P2_0 | C5 | D3 | LED-5V | D4 | D5 | C9 | C10 | C7 | R8 | C6 | C8 | D1 | B1 | R10 | C2 | R3 | LED-RPI | RPI PWR | Q1 | IC3 | JP2 | J5 | R4 | CYPI Bridge | LED2 | CY8C4245 | Rev02 | Rev02 | C12 | C11 | J6 | GND | GPIO9 | GPIO10 | 3.3V | GPIO22 | GPIO21 | GPIO17 | GND | GPIO4 | SCL | SDA | 3v3 | GPIO11 | R2 | R1 | 25 | R5 | 26 | GPIO7 | GPIO8 | GPIO25 | GND | GPIO24 | GPIO23 | GND | GPIO18 | GPIO15 | GPIO14 | GND | 5v | 5v | J7 | 25 | R6 | R7 | J4 | D0 P0_4 | D1 P0_5 | D2 P0_7 | D3 P3_7 | D4 P0_0 | D5 P3_5 | D6 P1_0 | D7 P2_7 | J3 | D8 P2_6 | D9 P3_6 | D10 P3_4 | D11 P4_2 | D12 P4_3 | D13 P0_6 | GND | Aref P1_7 | SDA P4_1 | SCL P4_0 | 26